# EAGLE design Bi-Quad Filter (EAGLE 9.6.2)
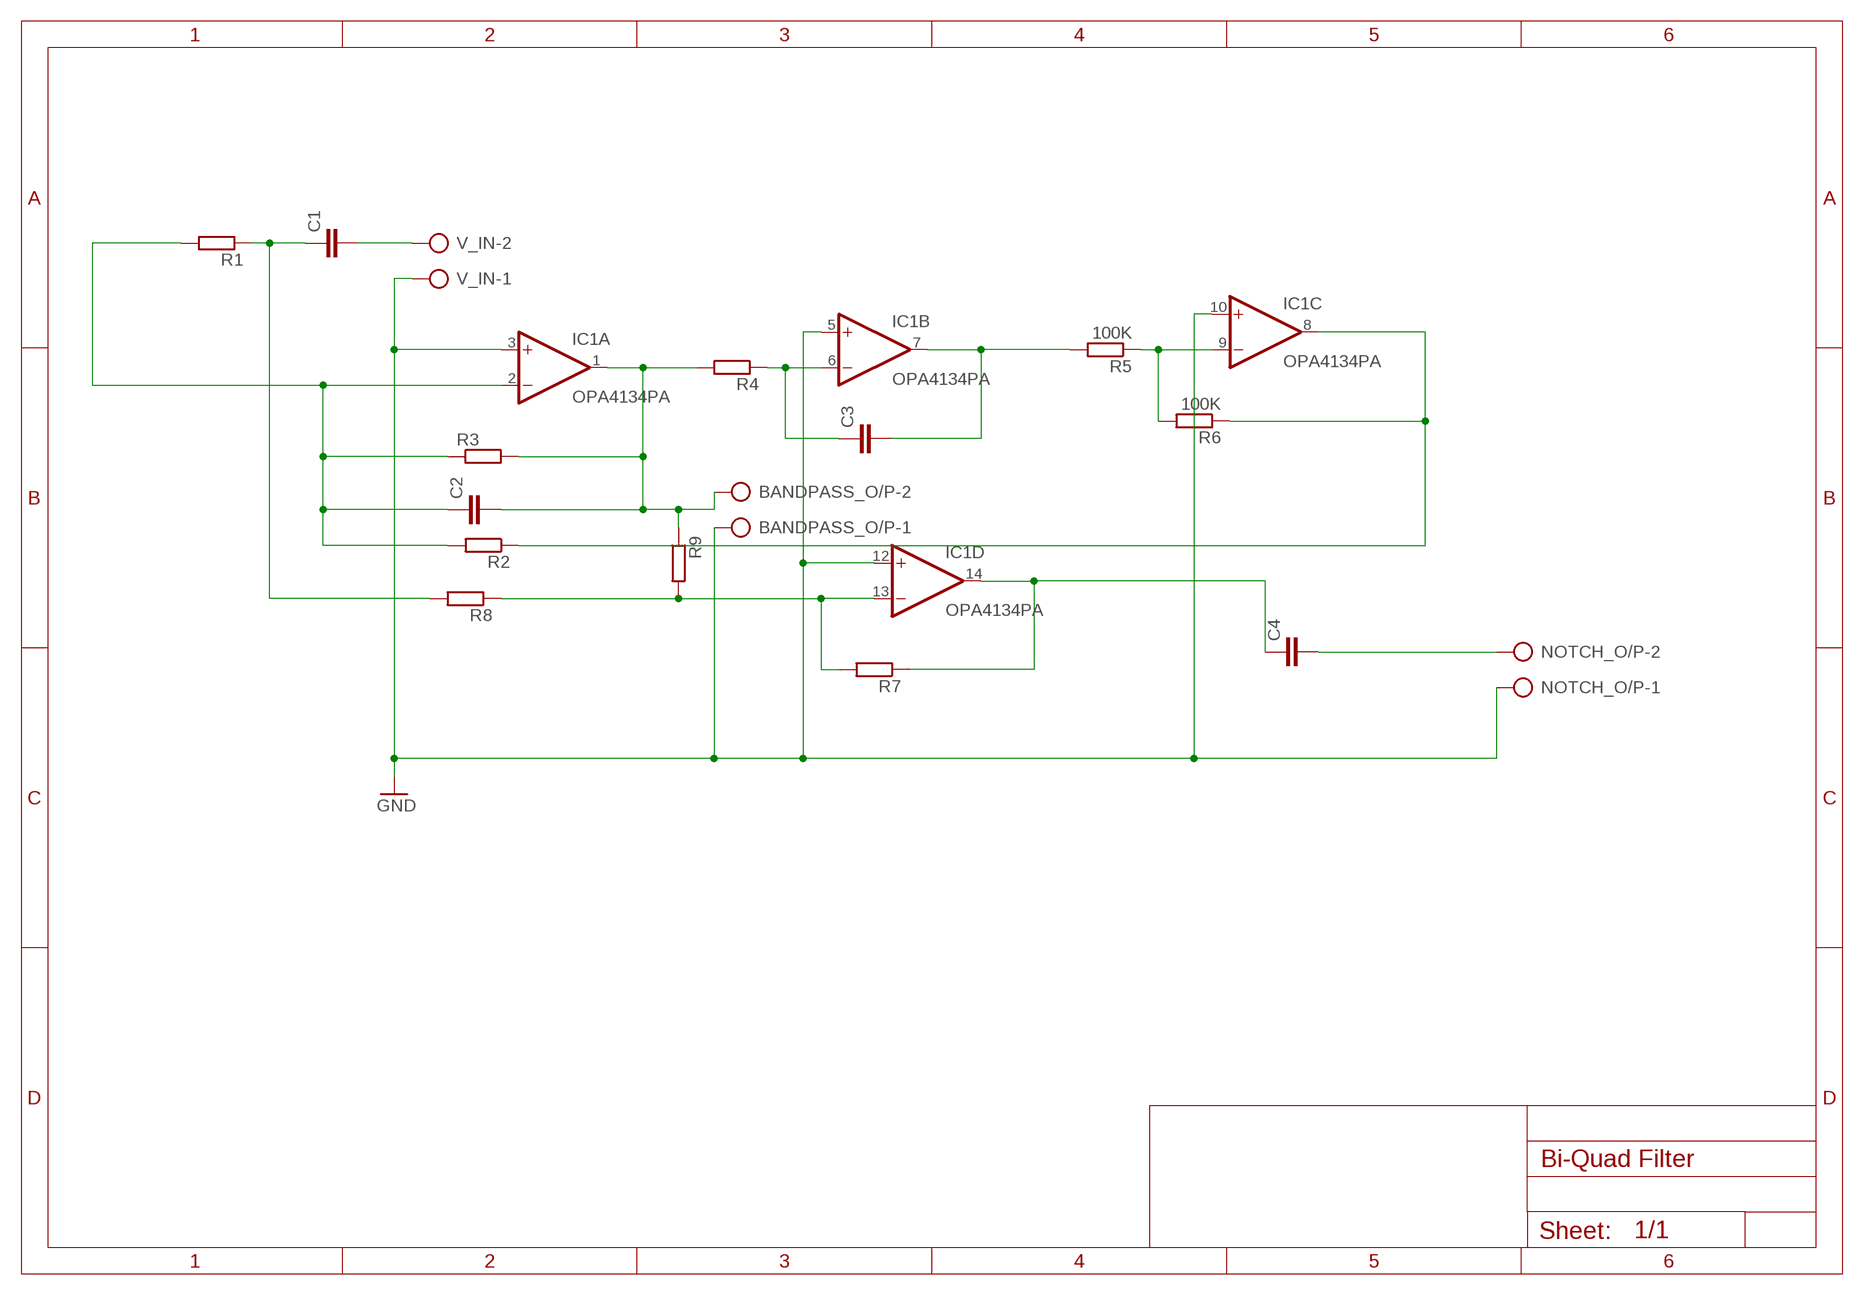
[diagram p0: schematic, sheet 1]

## Parts
BANDPASS_O/P  AK300/2  [AK300/2]
C1  C-EU050-024X044  [C050-024X044]
C2  C-EU050-024X044  [C050-024X044]
C3  C-EU050-024X044  [C050-024X044]
C4  C-EU050-024X044  [C050-024X044]
IC1  OPA4134PA  [DIL14]
NOTCH_O/P  AK300/2  [AK300/2]
R1  R-EU_0204/5  [0204/5]
R2  R-EU_0204/5  [0204/5]
R3  R-EU_0204/5  [0204/5]
R4  R-EU_0204/5  [0204/5]
R5  100K  R-EU_0204/5  [0204/5]
R6  100K  R-EU_0204/5  [0204/5]
R7  R-EU_0204/5  [0204/5]
R8  R-EU_0204/5  [0204/5]
R9  R-EU_0204/5  [0204/5]
V_IN  AK300/2  [AK300/2]

## Nets
GND: BANDPASS_O/P.1 IC1.3(A:+IN) IC1.5(B:+IN) IC1.10(C:+IN) IC1.12(D:+IN) NOTCH_O/P.1 V_IN.1
N$1: C1.2 V_IN.2
N$2: C1.1 R1.1 R8.2
N$3: C2.1 IC1.2(A:-IN) R1.2 R2.2 R3.1
N$4: IC1.8(C:OUT) R2.1 R6.1
N$5: C3.1 IC1.6(B:-IN) R4.1
N$6: BANDPASS_O/P.2 C2.2 IC1.1(A:OUT) R3.2 R4.2 R9.1
N$7: IC1.9(C:-IN) R5.1 R6.2
N$8: C3.2 IC1.7(B:OUT) R5.2
N$9: IC1.13(D:-IN) R7.2 R8.1 R9.2
N$10: C4.1 IC1.14(D:OUT) R7.1
N$11: C4.2 NOTCH_O/P.2

## Power pins joined to a net without a drawn wire
V+: IC1.4(P:V+)
V-: IC1.11(P:V-)

## Library data of the parts
BANDPASS_O/P NOTCH_O/P V_IN = con-ptr500:AK300/2: CONNECTOR; OC_FARNELL: unknown; OC_NEWARK: unknown
C1-C4 = rcl:C-EU: CAPACITOR, European symbol; SPICEPREFIX: C
IC1 = linear:OPA4*: Quad Operational Amplifier compatible with: TLC27L4 Low Power, Single-Supply, Rail-To-Rail Operational Amplifier Source: http://focus.ti.com/lit/ds/symlink/opa2345.pdf http://focus.ti.com .. opa241.pdf http://focus.ti.com .. tlc27l4.pdf http://focus.ti.com/lit/ds/symlink/opa2134.pdf
R1-R9 = rcl:R-EU_: RESISTOR, European symbol; SPICEPREFIX: R

## Board
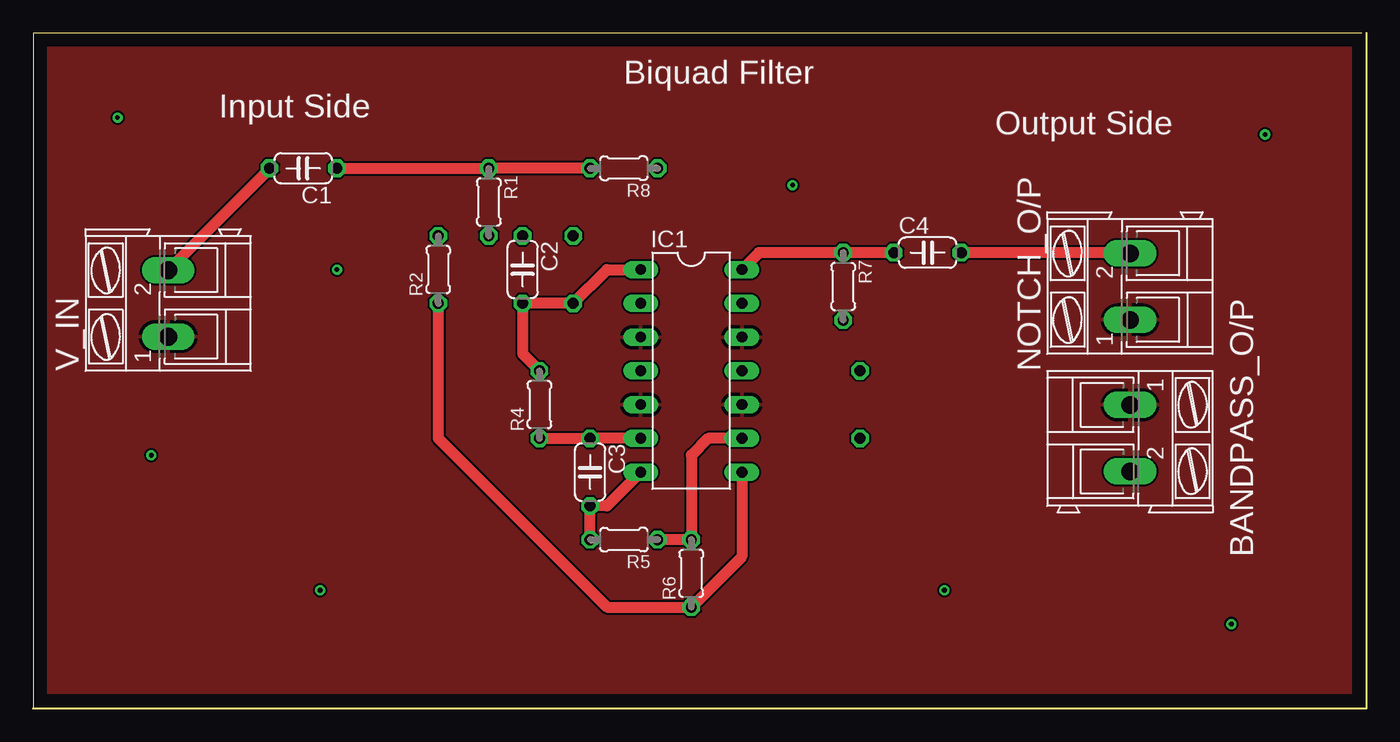
[diagram p1: board, top side]
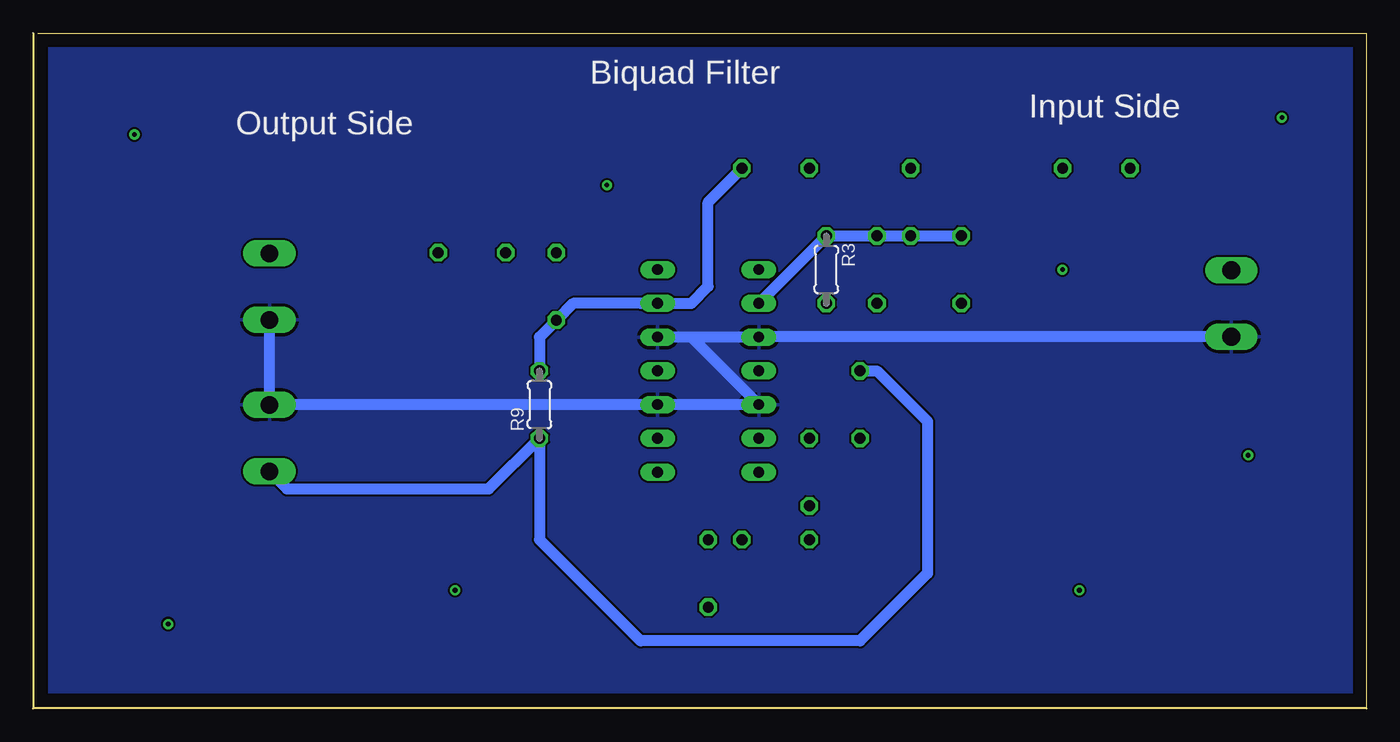
[diagram p2: board, bottom side, seen from below]

Size 100.33 x 50.8 mm. Coordinates in mm from the lower left corner, seen from the top.
Outline: 100,50.79 0,50.79 0,0 100.33,0 100.33,50.8
Copper layers (1*16): Top 0.035mm / dielectric 1.5mm / Bottom 0.035mm
Design rules "default": minimum track width 6mil, minimum drill 0.35mm, track to track 6mil, track to pad 6mil, pad to pad 6mil, via to via 6mil, smd to smd 6mil, copper to edge 40mil, drill to drill 6mil, minimum pad ring 10mil, minimum via ring 8mil, stop-mask expansion 4mil, vias tented up to drill 0mil, thermal gap 10mil

### Footprints (pad centres in the part's own frame; a part is rotated, then mirrored left to right if it is on the bottom)
AK300/2 = drill 1.321 long: 1 -2.515,0; 2 2.489,0
C050-024X044 = drill 0.813 octagon: 1 -2.54,0; 2 2.54,0
DIL14 = drill 0.813 long: 1 -7.62,-3.81; 2 -5.08,-3.81; 3 -2.54,-3.81; 4 0,-3.81; 5 2.54,-3.81; 6 5.08,-3.81; 7 7.62,-3.81; 8 7.62,3.81; 9 5.08,3.81; 10 2.54,3.81; 11 0,3.81; 12 -2.54,3.81; 13 -5.08,3.81; 14 -7.62,3.81
0204/5 = drill 0.813 octagon: 1 -2.54,0; 2 2.54,0

### Placement (x,y rotation side)
BANDPASS_O/P  82.55,20.32 270 top
C1  20.32,40.64 180 top
C2  36.83,33.02 270 top
C3  41.91,17.78 270 top
C4  67.31,34.29 0 top
IC1  49.53,25.4 270 top
NOTCH_O/P  82.55,31.75 90 top
R1  34.29,38.1 270 top
R2  30.48,33.02 90 top
R3  40.64,33.02 270 bottom
R4  38.1,22.86 90 top
R5  44.45,12.7 180 top
R6  49.53,10.16 90 top
R7  60.96,31.75 270 top
R8  44.45,40.64 180 top
R9  62.23,22.86 90 bottom
V_IN  10.16,30.48 90 top

### Tracks (layer width: path | path; a pad name or v marks a point on that pad's centre or on a via)
GND
  Bottom 0.813: NOTCH_O/P.1 BANDPASS_O/P.1 82.53,22.86 IC1.10 IC1.5 50.8,27.94 IC1.12 IC1.3 45.7,27.96 V_IN.1
  pour Bottom: 0,50.8 100.33,50.8 100.33,0 0,0
  pour Top: 0,50.8 0,0 100.33,0 100.33,50.8
N$1
  Top 0.813: V_IN.2 17.78,40.59 C1.2
N$2
  Top 0.813: C1.1 R1.1 R8.2
N$3
  Bottom 0.813: IC1.2 R3.1 C2.1 R1.2 R2.2
N$4
  Top 0.813: R2.1 30.48,20.32 43.18,7.62 R6.1 53.34,11.43 IC1.8
N$5
  Top 0.813: IC1.6 C3.1 R4.1
N$6
  Top 0.813: IC1.1 43.18,33.02 R3.2 C2.2 36.83,26.67 R4.2
  Bottom 0.813: BANDPASS_O/P.2 81.23,16.51 66.04,16.51 R9.1 62.23,12.7 54.61,5.08 38.1,5.08 33.02,10.16 33.02,21.59 36.83,25.4 R4.2
N$7
  Top 0.813: R5.1 R6.2 49.53,19.05 50.8,20.32 IC1.9
N$8
  Top 0.813: IC1.7 43.18,15.24 C3.2 R5.2
N$9
  Bottom 0.813: 54.61,30.48 IC1.13 | IC1.13 59.69,30.48 R7.2 62.23,27.94 R9.2 | IC1.13 50.8,30.48 49.53,31.75 49.53,38.1 R8.1
N$10
  Top 0.813: C4.1 R7.1 54.61,34.29 IC1.14
N$11
  Top 0.813: NOTCH_O/P.2 82.5,34.29 C4.2
N$12  (via drill 0.35)
  other vias: 8.89,19.05
N$13  (via drill 0.35)
  other vias: 21.59,8.89
N$14  (via drill 0.35)
  other vias: 6.35,44.45
N$15  (via drill 0.35)
  other vias: 68.58,8.89
N$16  (via drill 0.35)
  other vias: 90.17,6.35
N$17  (via drill 0.35)
  other vias: 92.71,43.18
N$18  (via drill 0.35)
  other vias: 57.15,39.37
N$19  (via drill 0.35)
  other vias: 22.86,33.02

### Text on the board
tNames: Biquad Filter | Input Side | Output Side
bNames: Biquad Filter | Input Side | Output Side